# Altium schematic sheet Sheet1.SchDoc
size A4; SheetNumber: 1; SheetTotal: 1
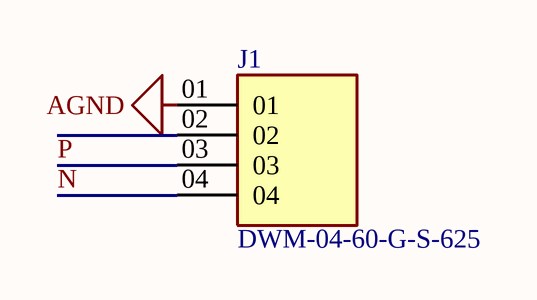
[diagram p0: Sheet1.SchDoc]

## Parts
J1  DWM-04-60-G-S-625  [SAMTEC_DWM-04-60-G-S-625]

## Nets
AGND: J1.01
N: J1.04
P: J1.03

Not connected (* = marked no-connect by the designer): J1 02

## Library data of the parts
J1 = DWM-04-60-G-S-625: CONN BRD STACK .050 4POS; MF: Samtec; SnapEDA_Link: https://www.snapeda.com/parts/DWM-04-60-G-S-625/Samtec/view-part/?ref=snap; Package: None; Value: *; MP: DWM-04-60-G-S-625; Check_prices: https://www.snapeda.com/parts/DWM-04-60-G-S-625/Samtec/view-part/?ref=eda